# EAGLE schematic 4069-Twin-T-Drums-PinConn (EAGLE 7.2.0)
Twin-T Analog Drum Voice using CD40106
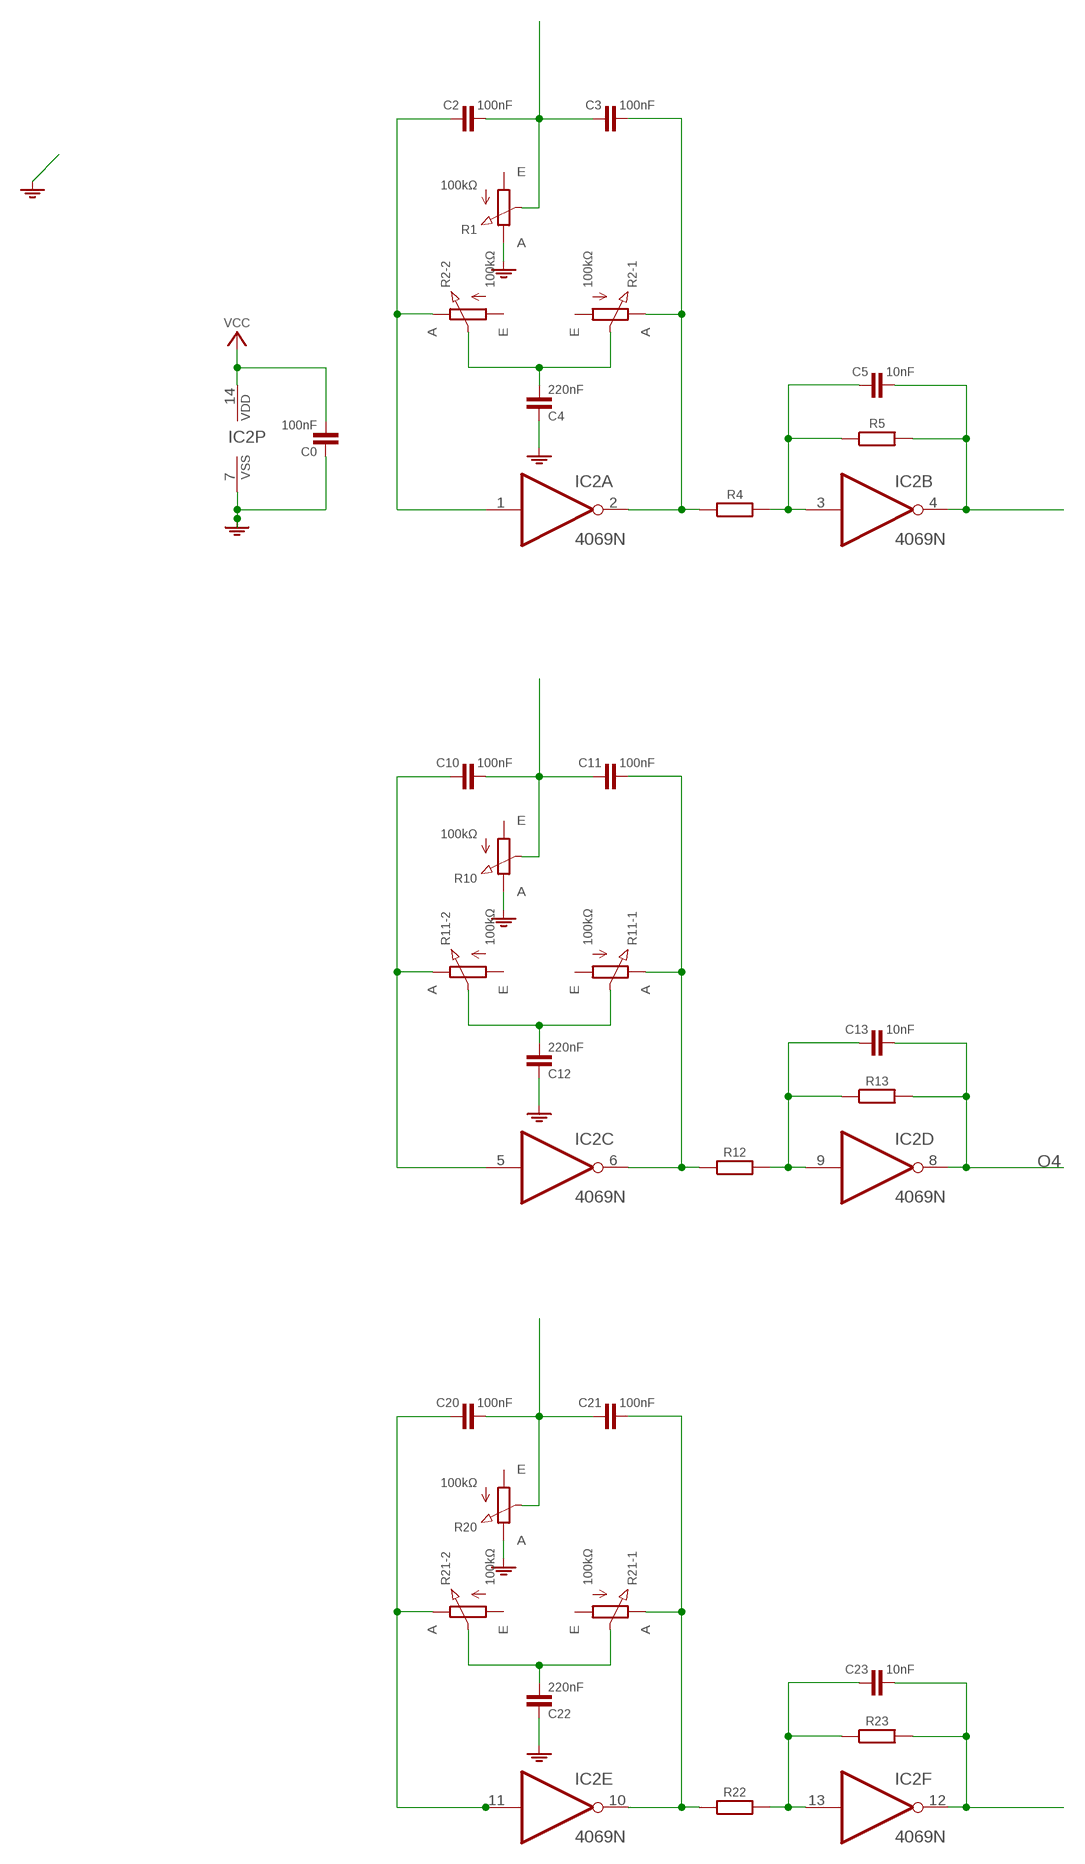
[diagram p0: schematic, sheet 1]

## Parts
C0  100nF  C050-020X044/V  [C050-020X044/V]
C2  100nF  C-H050-020X044  [C050-020X044]
C3  100nF  C-H050-020X044  [C050-020X044]
C4  220nF  C050-020X044/V  [C050-020X044/V]
C5  10nF  C-H025-015X024  [C025-015X024]
C10  100nF  C-H050-020X044  [C050-020X044]
C11  100nF  C-H050-020X044  [C050-020X044]
C12  220nF  C050-020X044/V  [C050-020X044/V]
C13  10nF  C-H025-015X024  [C025-015X024]
C20  100nF  C-H050-020X044  [C050-020X044]
C21  100nF  C-H050-020X044  [C050-020X044]
C22  220nF  C050-020X044/V  [C050-020X044/V]
C23  10nF  C-H025-015X024  [C025-015X024]
IC2  4069N  [DIL14]
R1  100kΩ  POT-3P  [CONN-3P]
R2  100kΩ  POT-STEREO2X3P  [CONN-2X3P]
R4  R-H0202/2V  [0202/2V]
R5  R-H0202/2V  [0202/2V]
R10  100kΩ  POT-3P  [CONN-3P]
R11  100kΩ  POT-STEREO2X3P  [CONN-2X3P]
R12  R-H0202/2  [0202/2]
R13  R-H0202/2V  [0202/2V]
R20  100kΩ  POT-3P  [CONN-3P]
R21  100kΩ  POT-STEREO2X3P  [CONN-2X3P]
R22  R-H0202/2V  [0202/2V]
R23  R-H0202/2V  [0202/2V]
S12  VCC_GNDPWR-L  [PWR-L]

## Nets
DR1: C4.2 R2.3(-1:S) R2.6(-2:S)
DR2: C12.2 R11.3(-1:S) R11.6(-2:S)
DR3: C22.2 R21.3(-1:S) R21.6(-2:S)
GND: C0.1 C4.1 C12.1 C22.1 IC2.7(P:VSS) R1.3(E) R10.3(E) R20.3(E) S12.1
I1: C2.1 IC2.1(A:I) R2.5(-2:E)
I2: C5.1 IC2.3(B:I) R4.2 R5.1
I3: C10.1 IC2.5(C:I) R11.5(-2:E)
I4: C13.1 IC2.9(D:I) R12.2 R13.1
I5: C20.1 IC2.11(E:I) R21.5(-2:E)
I6: C23.1 IC2.13(F:I) R22.2 R23.1
O1: C3.2 IC2.2(A:O) R2.2(-1:E) R4.1
O2: C5.2 IC2.4(B:O) R5.2
O3: C11.2 IC2.6(C:O) R11.2(-1:E) R12.1
O4: C13.2 IC2.8(D:O) R13.2
O5: C21.2 IC2.10(E:O) R21.2(-1:E) R22.1
O6: C23.2 IC2.12(F:O) R23.2
TR1: C2.2 C3.1 R1.2(S)
TR2: C10.2 C11.1 R10.2(S)
TR3: C20.2 C21.1 R20.2(S)
VCC: C0.2 IC2.14(P:VDD) S12.2
Unconnected: R1.1(A) R2.1(-1:A) R2.4(-2:A) R10.1(A) R11.1(-1:A) R11.4(-2:A) R20.1(A) R21.1(-1:A) R21.4(-2:A)

## Library data of the parts
C0 C4 C12 C22 = c:C: CAPACITOR, European symbol
C2 C3 C5 C10 C11 C13 C20 C21 C23 = c:C-H
IC2 = ic:4069: Hex INVERTER
R1 R10 R20 = r:POT
R2 R11 R21 = r:POT-STEREO
R4 R5 R12 R13 R22 R23 = r:R-H
S12 = pad:VCC_GND

## Net classes
0 default: width 0.61 mm, clearance 0.305 mm